# Altium project CarrierMotherboard.PrjPcb (part 1 of 3)
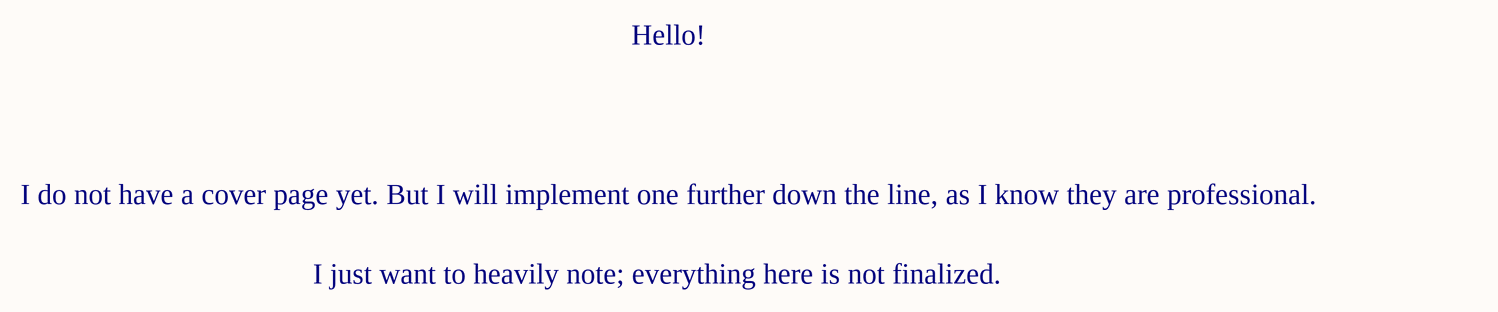
[diagram p0: COVER PAGE.SchDoc]
9 sheets, 274 parts. Net scope: flat (ports and power ports of the same name join across sheets).
Board file: CarrierMotherboard.PcbDoc
Sheets:
  COVER PAGE.SchDoc
  SoM.SchDoc
  eDP.SchDoc
  Power_Delivery.SchDoc
  Battery.SchDoc
  DCDC.SchDoc
  Peripherals.SchDoc
  Audio.SchDoc
  PCIE.SchDoc

## Sheet COVER PAGE.SchDoc
size A; SheetNumber: 1; SheetTotal: 9

### Notes on the sheet
- Hello!
- I do not have a cover page yet. But I will implement one further down the line, as I know they are professional.
- I just want to heavily note; everything here is not finalized.

## Sheet SoM.SchDoc
size A2; SheetNumber: 2; SheetTotal: 9
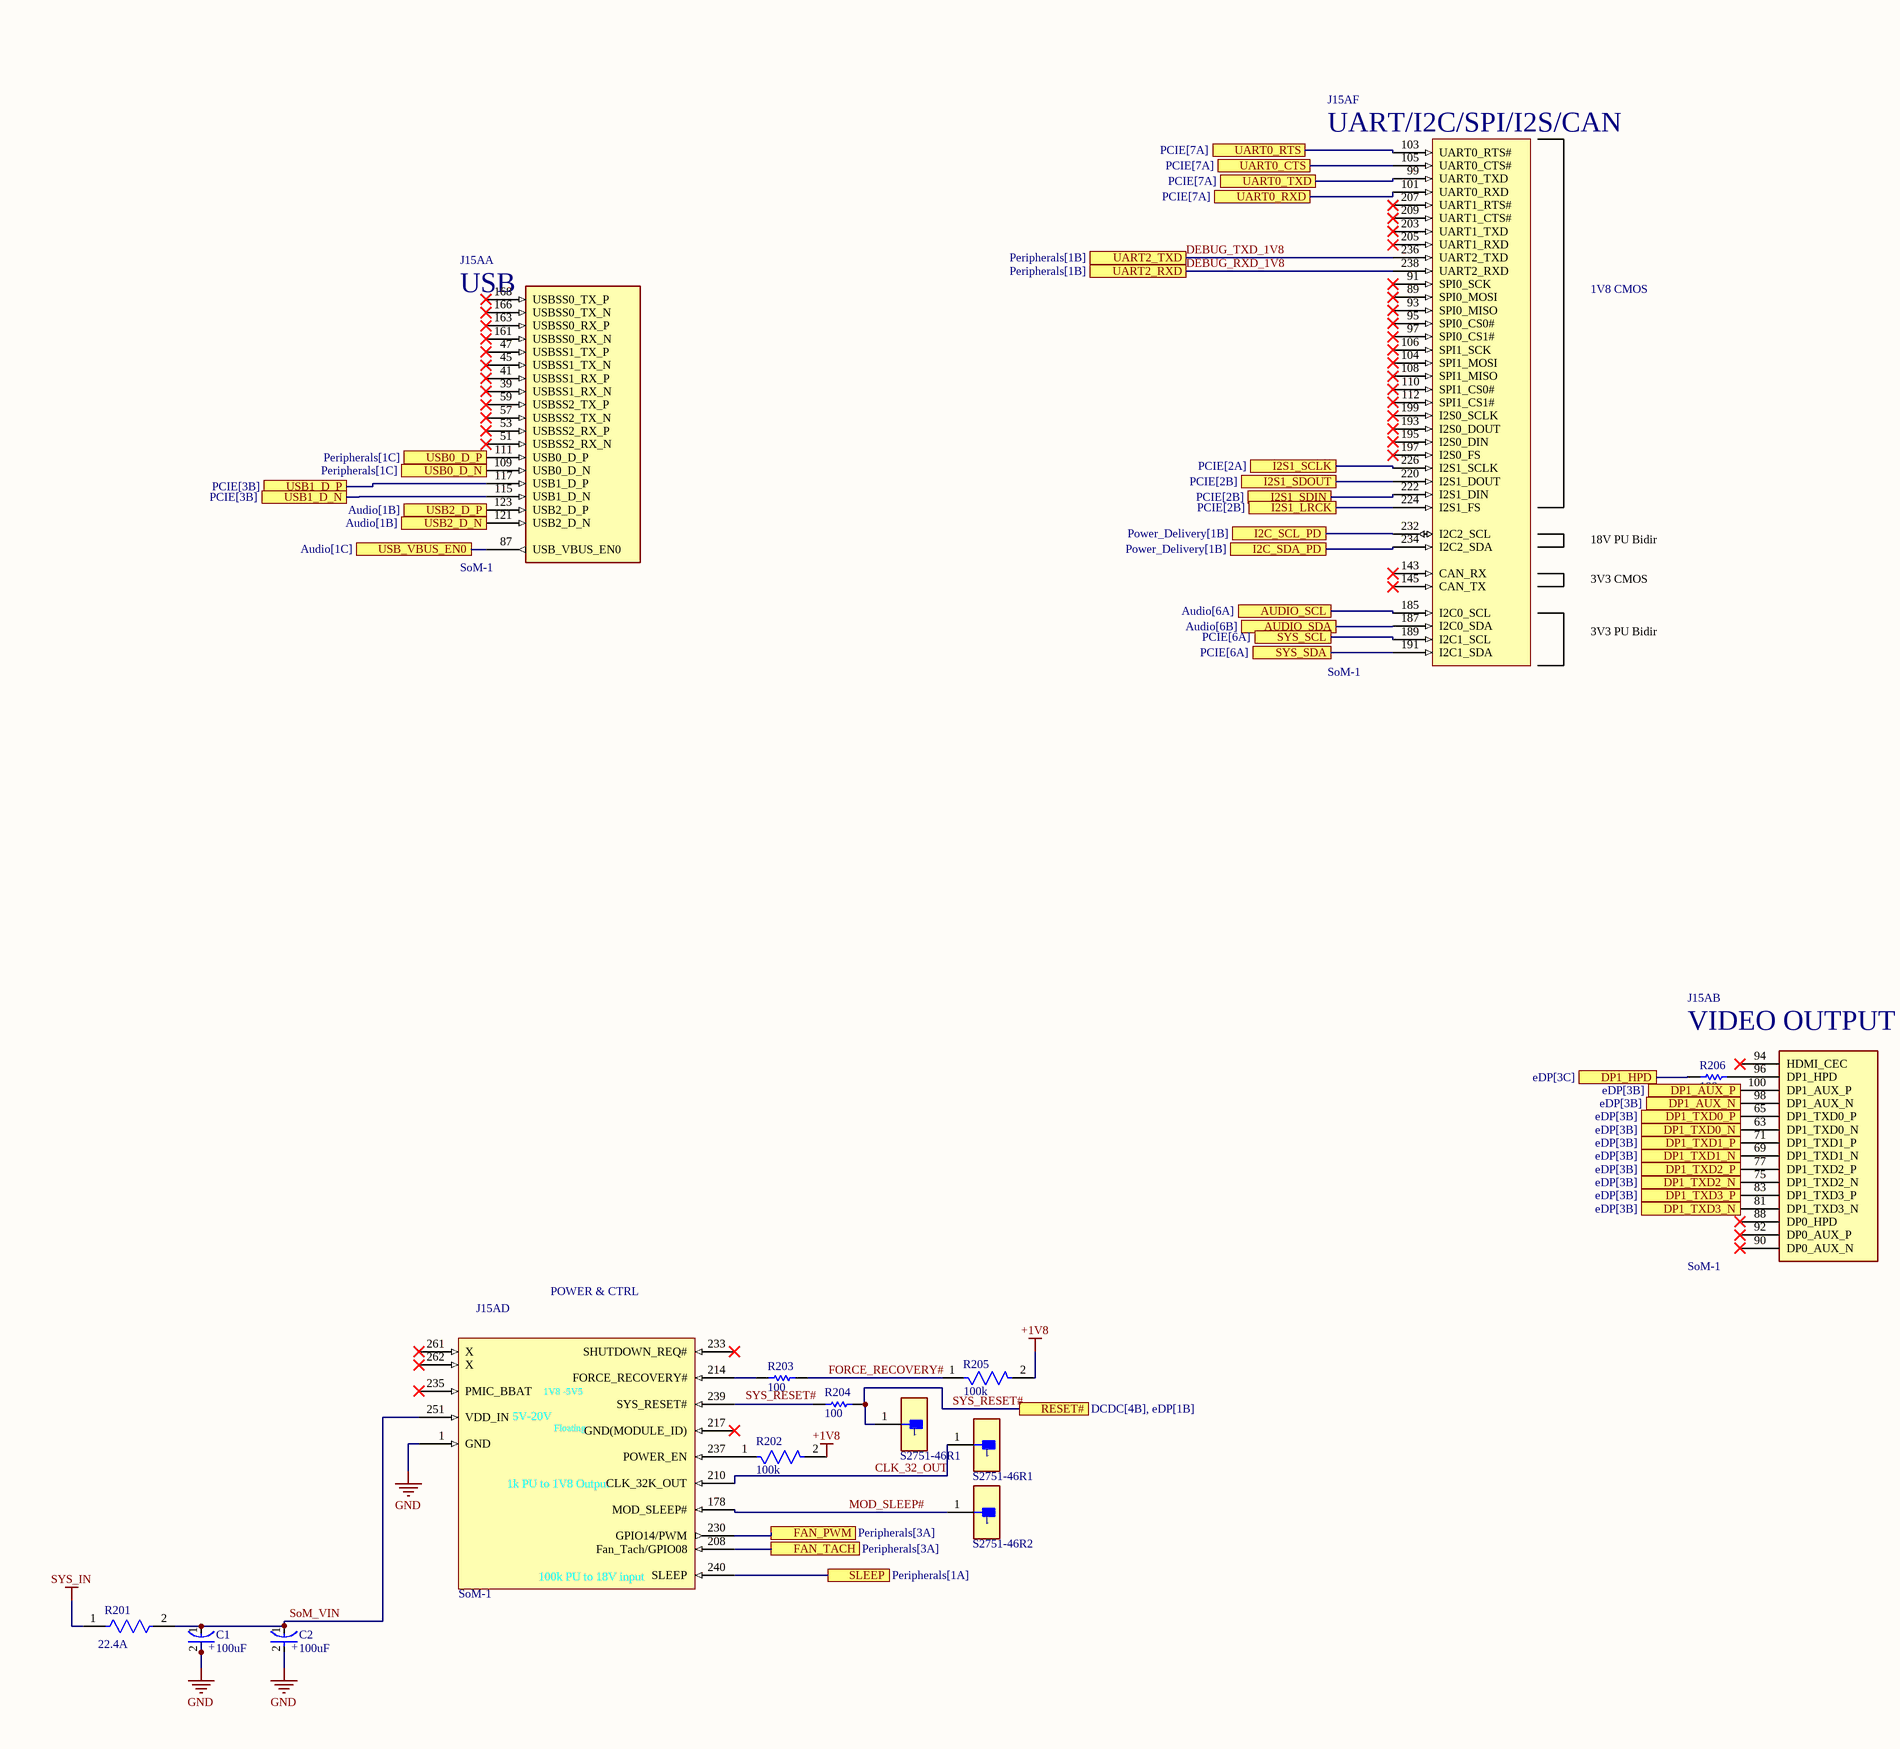
[diagram p1: SoM.SchDoc, left]
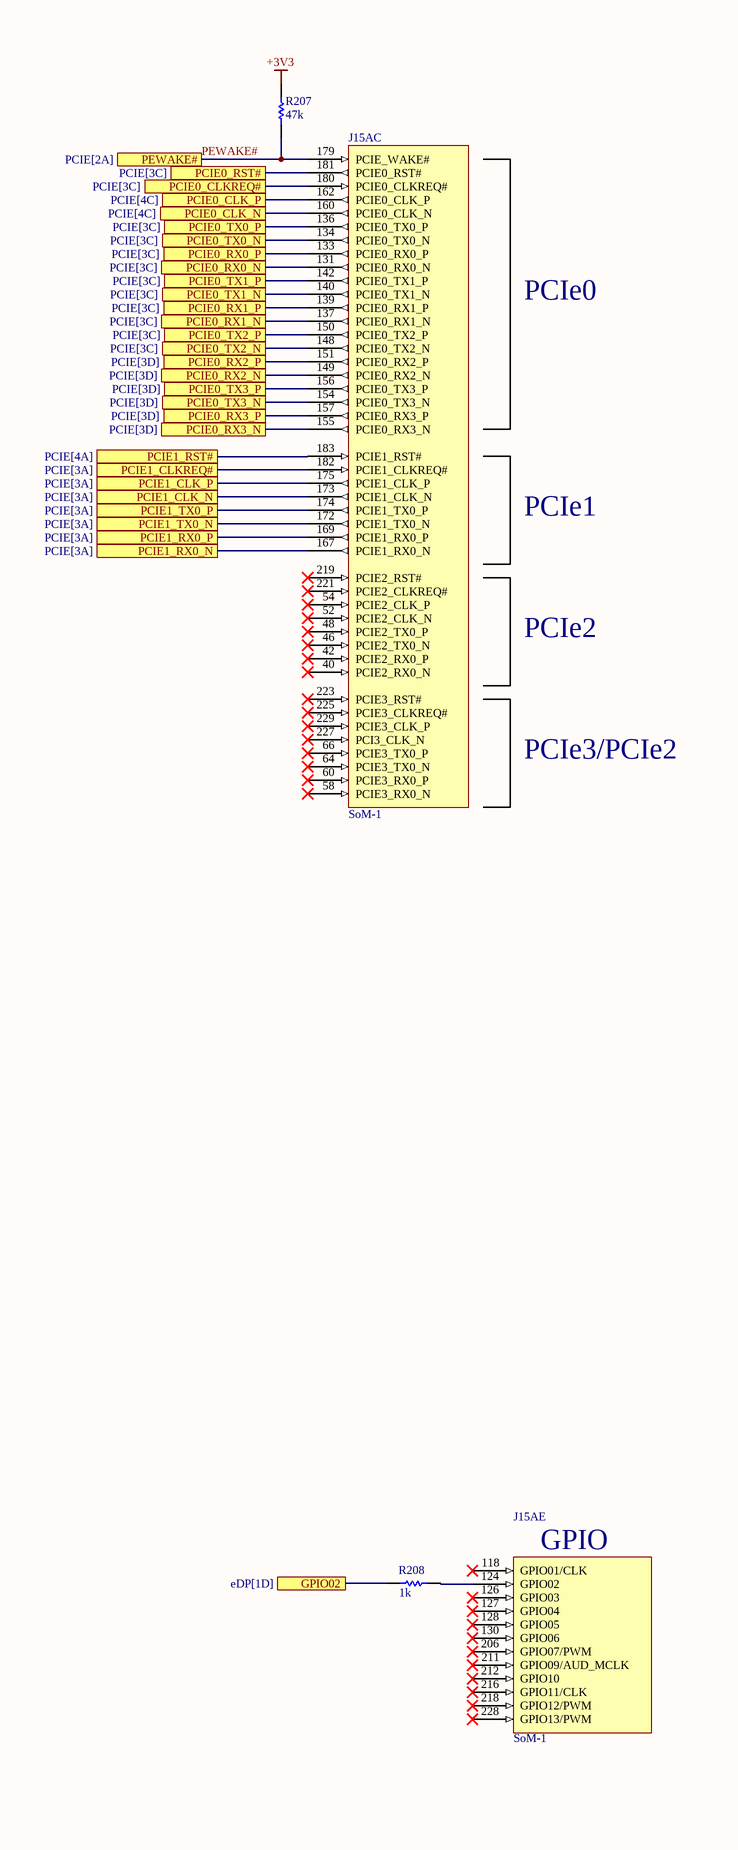
[diagram p2: SoM.SchDoc, right]

### Parts
C1  100uF  [FP-T521D107M025ATE040-MFG]
C2  100uF  [FP-T521D107M025ATE040-MFG]
J15A  SoM-1  [FP-2309413-1-MFG]  (parts A,B,C,D,E,F of 8)
J201  S2751-46R1  [FP-S2751-46R-MFG]
J202  S2751-46R1  [FP-S2751-46R-MFG]
J203  S2751-46R2  [FP-S2751-46R-MFG]
R201  22.4A  [FP-HCJ0603-MFG]
R202  100k  [FP-RC0402-0_4-IPC_A]
R203  100  [RESC1005X40X25ML05T10]
R204  100  [RESC1005X40X25ML05T10]
R205  100k  [FP-RC0402-0_4-IPC_A]
R206  100  [RESC1005X40X25ML05T10]
R207  47k  [RESC1005X40X25ML05T10]
R208  1k  [RESC3216X60X45ML15T20]

### Ports
AUDIO_SCL (see Audio[6A]), AUDIO_SDA (see Audio[6B]), DP1_AUX_N (see eDP[3B]), DP1_AUX_P (see eDP[3B]), DP1_HPD (see eDP[3C]), DP1_TXD0_N (see eDP[3B]), DP1_TXD0_P (see eDP[3B]), DP1_TXD1_N (see eDP[3B]), DP1_TXD1_P (see eDP[3B]), DP1_TXD2_N (see eDP[3B]), DP1_TXD2_P (see eDP[3B]), DP1_TXD3_N (see eDP[3B]), DP1_TXD3_P (see eDP[3B]), FAN_PWM (see Peripherals[3A]), FAN_TACH (see Peripherals[3A]), GPIO02 (see eDP[1D]), I2C_SCL_PD (see Power_Delivery[1B]), I2C_SDA_PD (see Power_Delivery[1B]), I2S1_LRCK (see PCIE[2B]), I2S1_SCLK (see PCIE[2A]), I2S1_SDIN (see PCIE[2B]), I2S1_SDOUT (see PCIE[2B]), PCIE0_CLK_N (see PCIE[4C]), PCIE0_CLK_P (see PCIE[4C]), PCIE0_CLKREQ# (see PCIE[3C]), PCIE0_RST# (see PCIE[3C]), PCIE0_RX0_N (see PCIE[3C]), PCIE0_RX0_P (see PCIE[3C]), PCIE0_RX1_N (see PCIE[3C]), PCIE0_RX1_P (see PCIE[3C]), PCIE0_RX2_N (see PCIE[3D]), PCIE0_RX2_P (see PCIE[3D]), PCIE0_RX3_N (see PCIE[3D]), PCIE0_RX3_P (see PCIE[3D]), PCIE0_TX0_N (see PCIE[3C]), PCIE0_TX0_P (see PCIE[3C]), PCIE0_TX1_N (see PCIE[3C]), PCIE0_TX1_P (see PCIE[3C]), PCIE0_TX2_N (see PCIE[3C]), PCIE0_TX2_P (see PCIE[3C]), PCIE0_TX3_N (see PCIE[3D]), PCIE0_TX3_P (see PCIE[3D]), PCIE1_CLK_N (see PCIE[3A]), PCIE1_CLK_P (see PCIE[3A]), PCIE1_CLKREQ# (see PCIE[3A]), PCIE1_RST# (see PCIE[4A]), PCIE1_RX0_N (see PCIE[3A]), PCIE1_RX0_P (see PCIE[3A]), PCIE1_TX0_N (see PCIE[3A]), PCIE1_TX0_P (see PCIE[3A]), PEWAKE# (see PCIE[2A]), RESET# (see DCDC[4B], eDP[1B]), SLEEP (see Peripherals[1A]), SYS_SCL (see PCIE[6A]), SYS_SDA (see PCIE[6A]), UART0_CTS (see PCIE[7A]), UART0_RTS (see PCIE[7A]), UART0_RXD (see PCIE[7A]), UART0_TXD (see PCIE[7A]), UART2_RXD (see Peripherals[1B]), UART2_TXD (see Peripherals[1B]), USB0_D_N (see Peripherals[1C]), USB0_D_P (see Peripherals[1C]), USB1_D_N (see PCIE[3B]), USB1_D_P (see PCIE[3B]), USB2_D_N (see Audio[1B]), USB2_D_P (see Audio[1B]), USB_VBUS_EN0 (see Audio[1C])

### Nets
+1V8: R202.2 R205.2  [project net 1V8_LDO]
+3V3: R207.2  [project net 3V3_M2]
GND: C1.2(A) C2.2(A) J15A.1(GND)  [project net 3V3_VDRV]
SYS_IN: R201.1
C_PCIE0_RX0_N: J15A.131(PCIE0_RX0_N) ; port PCIE0_RX0_N
C_PCIE0_RX0_P: J15A.133(PCIE0_RX0_P) ; port PCIE0_RX0_P
C_PCIE0_RX1_N: J15A.137(PCIE0_RX1_N) ; port PCIE0_RX1_N
C_PCIE0_RX1_P: J15A.139(PCIE0_RX1_P) ; port PCIE0_RX1_P
C_PCIE0_RX2_N: J15A.149(PCIE0_RX2_N) ; port PCIE0_RX2_N
C_PCIE0_RX2_P: J15A.151(PCIE0_RX2_P) ; port PCIE0_RX2_P
C_PCIE0_TX0_N: J15A.134(PCIE0_TX0_N) ; port PCIE0_TX0_N
C_PCIE0_TX0_P: J15A.136(PCIE0_TX0_P) ; port PCIE0_TX0_P
C_PCIE0_TX1_N: J15A.140(PCIE0_TX1_N) ; port PCIE0_TX1_N
C_PCIE0_TX1_P: J15A.142(PCIE0_TX1_P) ; port PCIE0_TX1_P
C_PCIE0_TX2_N: J15A.148(PCIE0_TX2_N) ; port PCIE0_TX2_N
C_PCIE0_TX2_P: J15A.150(PCIE0_TX2_P) ; port PCIE0_TX2_P
C_PCIE0_TX3_N: J15A.154(PCIE0_TX3_N) ; port PCIE0_TX3_N
C_PCIE0_TX3_P: J15A.156(PCIE0_TX3_P) ; port PCIE0_TX3_P
CLK_32_OUT: J15A.210(CLK_32K_OUT) J202.1
DEBUG_RXD_1V8: J15A.238(UART2_RXD) ; port UART2_RXD
DEBUG_TXD_1V8: J15A.236(UART2_TXD) ; port UART2_TXD
FORCE_RECOVERY#: R203.2 R205.1
I2C_SCL_PD: J15A.232(I2C2_SCL) ; port I2C_SCL_PD
I2C_SDA_PD: J15A.234(I2C2_SDA) ; port I2C_SDA_PD
M2_E_I2C_CLK: J15A.189(I2C1_SCL) ; port SYS_SCL
M2_E_I2C_DAT: J15A.191(I2C1_SDA) ; port SYS_SDA
M2_M_CLKREQ0#: J15A.180(PCIE0_CLKREQ#) ; port PCIE0_CLKREQ#
M2_M_PERST#: J15A.181(PCIE0_RST#) ; port PCIE0_RST#
MOD_SLEEP#: J15A.178(MOD_SLEEP#) J203.1
PCIE0_RX3_N: J15A.155(PCIE0_RX3_N) ; port PCIE0_RX3_N
PCIE0_RX3_P: J15A.157(PCIE0_RX3_P) ; port PCIE0_RX3_P
PCIE1_RX0_N: J15A.167(PCIE1_RX0_N) ; port PCIE1_RX0_N
PCIE1_RX0_P: J15A.169(PCIE1_RX0_P) ; port PCIE1_RX0_P
PCIE1_TX0_P: J15A.174(PCIE1_TX0_P) ; port PCIE1_TX0_P
PEWAKE#: J15A.179(PCIE_WAKE#) R207.1 ; port PEWAKE#
POWER_BUTTON#: J15A.240(SLEEP) ; port SLEEP
SoM_VIN: C1.1(C) C2.1(C) J15A.251(VDD_IN) R201.2
SYS_RESET#: J201.1 R204.2 ; port RESET#
USB_D+: J15A.123(USB2_D_P) ; port USB2_D_P
USB_D-: J15A.121(USB2_D_N) ; port USB2_D_N
NetC102_1: J15A.172(PCIE1_TX0_N) ; port PCIE1_TX0_N
NetD703_1: J15A.109(USB0_D_N) ; port USB0_D_N
NetD704_1: J15A.111(USB0_D_P) ; port USB0_D_P
NetJ15A_63: J15A.63(DP1_TXD0_N) ; port DP1_TXD0_N
NetJ15A_65: J15A.65(DP1_TXD0_P) ; port DP1_TXD0_P
NetJ15A_69: J15A.69(DP1_TXD1_N) ; port DP1_TXD1_N
NetJ15A_71: J15A.71(DP1_TXD1_P) ; port DP1_TXD1_P
NetJ15A_75: J15A.75(DP1_TXD2_N) ; port DP1_TXD2_N
NetJ15A_77: J15A.77(DP1_TXD2_P) ; port DP1_TXD2_P
NetJ15A_81: J15A.81(DP1_TXD3_N) ; port DP1_TXD3_N
NetJ15A_83: J15A.83(DP1_TXD3_P) ; port DP1_TXD3_P
NetJ15A_87: J15A.87(USB_VBUS_EN0) ; port USB_VBUS_EN0
NetJ15A_96: J15A.96(DP1_HPD) R206.2
NetJ15A_98: J15A.98(DP1_AUX_N) ; port DP1_AUX_N
NetJ15A_99: J15A.99(UART0_TXD) ; port UART0_TXD
NetJ15A_100: J15A.100(DP1_AUX_P) ; port DP1_AUX_P
NetJ15A_101: J15A.101(UART0_RXD) ; port UART0_RXD
NetJ15A_103: J15A.103(UART0_RTS#) ; port UART0_RTS
NetJ15A_105: J15A.105(UART0_CTS#) ; port UART0_CTS
NetJ15A_115: J15A.115(USB1_D_N) ; port USB1_D_N
NetJ15A_117: J15A.117(USB1_D_P) ; port USB1_D_P
NetJ15A_124: J15A.124(GPIO02) R208.1
NetJ15A_160: J15A.160(PCIE0_CLK_N) ; port PCIE0_CLK_N
NetJ15A_162: J15A.162(PCIE0_CLK_P) ; port PCIE0_CLK_P
NetJ15A_173: J15A.173(PCIE1_CLK_N) ; port PCIE1_CLK_N
NetJ15A_175: J15A.175(PCIE1_CLK_P) ; port PCIE1_CLK_P
NetJ15A_182: J15A.182(PCIE1_CLKREQ#) ; port PCIE1_CLKREQ#
NetJ15A_183: J15A.183(PCIE1_RST#) ; port PCIE1_RST#
NetJ15A_185: J15A.185(I2C0_SCL) ; port AUDIO_SCL
NetJ15A_187: J15A.187(I2C0_SDA) ; port AUDIO_SDA
NetJ15A_208: J15A.208(Fan_Tach/GPIO08) ; port FAN_TACH
NetJ15A_214: J15A.214(FORCE_RECOVERY#) R203.1
NetJ15A_220: J15A.220(I2S1_DOUT) ; port I2S1_SDOUT
NetJ15A_222: J15A.222(I2S1_DIN) ; port I2S1_SDIN
NetJ15A_224: J15A.224(I2S1_FS) ; port I2S1_LRCK
NetJ15A_226: J15A.226(I2S1_SCLK) ; port I2S1_SCLK
NetJ15A_230: J15A.230(GPIO14/PWM) ; port FAN_PWM
NetJ15A_237: J15A.237(POWER_EN) R202.1
NetJ15A_239: J15A.239(SYS_RESET#) R204.1
NetJ301_27: R206.1 ; port DP1_HPD
NetR208_2: R208.2 ; port GPIO02

Not connected (* = marked no-connect by the designer): J15A 39(USBSS1_RX_N)* 40(PCIE2_RX0_N)* 41(USBSS1_RX_P)* 42(PCIE2_RX0_P)* 45(USBSS1_TX_N)* 46(PCIE2_TX0_N)* 47(USBSS1_TX_P)* 48(PCIE2_TX0_P)* 51(USBSS2_RX_N)* 52(PCIE2_CLK_N)* 53(USBSS2_RX_P)* 54(PCIE2_CLK_P)* 57(USBSS2_TX_N)* 58(PCIE3_RX0_N)* 59(USBSS2_TX_P)* 60(PCIE3_RX0_P)* 64(PCIE3_TX0_N)* 66(PCIE3_TX0_P)* 88(DP0_HPD)* 89(SPI0_MOSI)* 90(DP0_AUX_N)* 91(SPI0_SCK)* 92(DP0_AUX_P)* 93(SPI0_MISO)* 94(HDMI_CEC)* 95(SPI0_CS0#)* 97(SPI0_CS1#)* 104(SPI1_MOSI)* 106(SPI1_SCK)* 108(SPI1_MISO)* 110(SPI1_CS0#)* 112(SPI1_CS1#)* 118(GPIO01/CLK)* 126(GPIO03)* 127(GPIO04)* 128(GPIO05)* 130(GPIO06)* 143(CAN_RX)* 145(CAN_TX)* 161(USBSS0_RX_N)* 163(USBSS0_RX_P)* 166(USBSS0_TX_N)* 168(USBSS0_TX_P)* 193(I2S0_DOUT)* 195(I2S0_DIN)* 197(I2S0_FS)* 199(I2S0_SCLK)* 203(UART1_TXD)* 205(UART1_RXD)* 206(GPIO07/PWM)* 207(UART1_RTS#)* 209(UART1_CTS#)* 211(GPIO09/AUD_MCLK)* 212(GPIO10)* 216(GPIO11/CLK)* 217(GND(MODULE_ID))* 218(GPIO12/PWM)* 219(PCIE2_RST#)* 221(PCIE2_CLKREQ#)* 223(PCIE3_RST#)* 225(PCIE3_CLKREQ#)* 227(PCI3_CLK_N)* 228(GPIO13/PWM)* 229(PCIE3_CLK_P)* 233(SHUTDOWN_REQ#)* 235(PMIC_BBAT)* 261(X)* 262(X)*

### Notes on the sheet
- (near J15A) 1V8 -5V5
- (near J15A) 5V-20V
- (near J15A) Floating
- (near J15A) 1k PU to 1V8 Output
- (near J15A) 100k PU to 18V input
- Labels drawn without touching a wire or pin: SYS_RESET#
- (in symbol CMP-00001-1, part A) USB
- (in symbol CMP-00001-1, part B) VIDEO OUTPUT (eDP)
- (in symbol CMP-00001-1, part C) PCIe0; PCIe1; PCIe2; PCIe3/PCIe2
- (in symbol CMP-00001-1, part D) POWER & CTRL
- (in symbol CMP-00001-1, part E) GPIO
- (in symbol CMP-00001-1, part F) UART/I2C/SPI/I2S/CAN; 1V8 CMOS; 18V PU Bidir; 3V3 CMOS; 3V3 PU Bidir
- (in symbol CMP-03016-000026-1) +

### Library data of the parts
C1 C2 = CMP-03016-000026-1: CAP TANT POLY 100UF 25V 2917; Tolerance: 20%; ESR (Equivalent Series Resistance): 40mR; Min Operating Temperature: -55°C; Voltage Rating: 25V; Width: 0.169inch; Case Code (Imperial): 2917; Packaging: Cut Tape; Max Operating Temperature: 105°C; Length: 0.287inch; Capacitance: 100uF; Voltage Rating (DC): 25V; Features: General Purpose; REACH SVHC: No SVHC; Height - Seated (Max): 0.122inch; Series: KO-CAP® T521; Case/Package: 2917; Case Code (Metric): 7343; Mount: Surface Mount
J15A = CMP-00001-1: Memory Card Connector, DDR4, SODIMM, Cam-In Locking, 260 Contacts, Copper Alloy; Manufacturer Lifecycle Status: ACTIVE; Number of Contacts: 260; Pitch: 500µm; Circuit Application: Power; Voltage Rating: 25V; Max Current Rating: 500mA; Dielectric Material: Polyethylene; Row Spacing: 8.2mm; Shielding: No; Memory Format: DDR, SDRAM; Number of Ports: 1; Contact Material: Gold, Nickel; Lifecycle Status: Production; Packaging: Tape & Reel; Mounting Technology: Surface Mount; Contact Gender: Female; Flammability Rating: UL94 V-0; Height: 18.8mm; Source: 4d1075b24ee2591bdcd47d674b3d2aa.SchLib; Pins: 260; Min Operating Temperature: -55°C; Orientation: Right Angle; Housing Color: Black; Housing Material: Thermoplastic; Sealable: No; Number of Positions: 260; Current Rating: 500mA; RoHS: Compliant; Number of Rows: 2; Contact Plating: Gold, Nickel; China RoHS: Compliant; Terminal Pitch: 500µm; Max Operating Temperature: 85°C; Contact Current Rating: 500mA; Schedule B: 8536694040, 8536694040; REACH SVHC: Yes
J201-J203 = CMP-15817-000010-1: PC TEST POINT NATURAL; Plating: Tin; Body Material: Brass; Color: Natural; Material: Copper Alloy; Mount: Surface Mount; Packaging: Cut Tape
R201 = CMP-26527-000122-1: RES 0 OHM JUMPER 1/4W 0603; Resistance: 0mR; Termination: Wraparound; Mount: Surface Mount; Min Operating Temperature: -55°C; Number of Terminations: 2; Packaging: Tape and Reel; Case Code (Imperial): 0603; Height: 0.021inch; RoHS Compliant: Yes; Width: 0.031inch; Package Quantity: 5000; Max Operating Temperature: 155°C; Radiation Hardening: No; Case/Package: 0603; Length: 0.061inch; Case Code (Metric): 1608
R202 R205 = CMP-2002-07913-2: RES 100K OHM 5% 1/16W 0402; Temperature Coefficient: 100ppm/°C; Max Power Dissipation: 63mW; Resistance: 100kR; Voltage Rating: 50V; Tolerance: 5%; Packaging: Tape and Reel; Termination: SMD/SMT; Case Code (Metric): 1005; Length: 1mm; Power Rating: 63mW; Min Operating Temperature: -55°C; Case/Package: 0402; Construction: Rectangular; Series: RC; Resistance Tolerance: 5%; Height: 0.016inch; Case Code (Imperial): 0402; RoHS Compliant: Yes; Size Code: 0402; Number of Terminations: 2; Features: Moisture Resistant; Width: 0.02inch; Max Operating Temperature: 155°C; Military Standard: Not; Lead Free: Lead Free; Depth: 0.5mm; Package Quantity: 1; Resistor Type: Thick Film
R203 R204 R206 = CMP-2002-07344-1: Part Number: RC0402FR-07100RL; Manufacturer: Yageo / Phycomp
R207 = CMP-2002-07701-1: Part Number: RC0402FR-0747KL; Manufacturer: Yageo / Phycomp
R208 = CMP-2100-03616-1: Chip Resistor, 1 KOhm, +/- 1%, 0.25 W, -55 to 155 degC, 1206 (3216 Metric), RoHS, Tape and Reel; Manufacturer: Vishay Semiconductor; Power Rating: 250mW; Voltage Rating (DC): 200V; Resistance: 1KOhm; Temperature Coefficient: 100ppm/degreesC; Case Code (Imperial): 1206; Length: 3.2mm; Case/Package: 1206; Contact Plating: Tin; Package Quantity: 10; Datasheet URL: http://www.farnell.com/datasheets/1720486.pdf; Mount: SurfaceMount; Package Description: 2-Pin Surface Mount Device, Body 3.15 x 1.6 mm; Package Reference: 1206.0; Max Operating Temperature: 155degC; Lead Free: LeadFree; Weight: 0.000353oz; Military Standard: Not; Max Power Dissipation: 250mW; Case Code (Metric): 3216; Number of Terminations: 2; Tolerance: 1%; Width: 0.063inch; Termination: SMD/SMT; Number of Pins: 2; Min Operating Temperature: -55degC; Height: 0.55mm; Depth: 1.6mm; RoHSCompliant: true; Composition: ThickFilm; Packaging: TapeandReel; Manufacturer URL: http://www.vishay.com/; Voltage Rating: 200V; Radiation Hardening: No; REACH SVHC: Unknown; Datasheet Version: 41061.0

## Sheet eDP.SchDoc
size A4; SheetNumber: 3; SheetTotal: 9
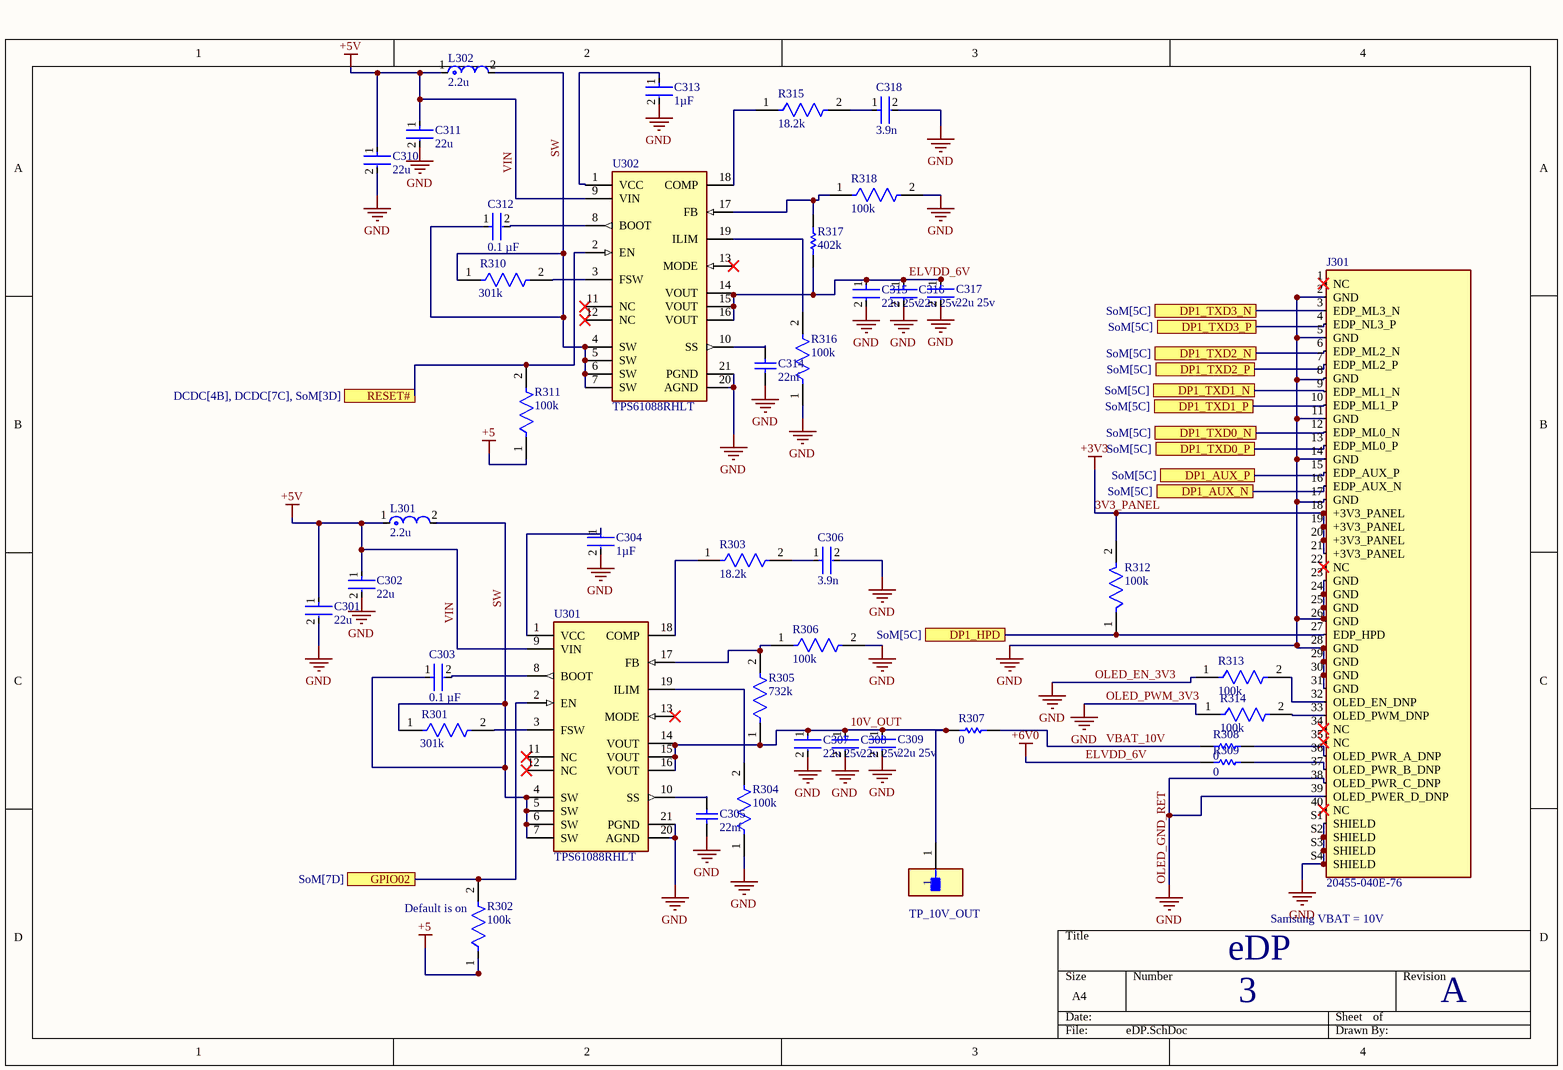
[diagram p3: eDP.SchDoc]

### Parts
C301  22u  [FP-CL10-IPC_B]
C302  22u  [FP-CL10-IPC_B]
C303  0.1 µF  [FP-GRM155-0_05-IPC_B]
C304  1µF  [FP-GRM15-0_1-MFG]
C305  22nf  [CAPC1608X90X35ML10T15]
C306  3.9n  [FP-GRM188-0_1-e0_2_0_5-IPC_B]
C307  22u 25v  [FP-GRM21B-0_2-e0_2_0_7-IPC_B]
C308  22u 25v  [FP-GRM21B-0_2-e0_2_0_7-IPC_B]
C309  22u 25v  [FP-GRM21B-0_2-e0_2_0_7-IPC_B]
C310  22u  [FP-CL10-IPC_B]
C311  22u  [FP-CL10-IPC_B]
C312  0.1 µF  [FP-GRM155-0_05-IPC_B]
C313  1µF  [FP-GRM15-0_1-MFG]
C314  22nf  [CAPC1608X90X35ML10T15]
C315  22u 25v  [FP-GRM21B-0_2-e0_2_0_7-IPC_B]
C316  22u 25v  [FP-GRM21B-0_2-e0_2_0_7-IPC_B]
C317  22u 25v  [FP-GRM21B-0_2-e0_2_0_7-IPC_B]
C318  3.9n  [FP-GRM188-0_1-e0_2_0_5-IPC_B]
J300  TP_10V_OUT  [FP-S2751-46R-MFG]
J301  20455-040E-76  [IPEX_20455-040E-76]
L301  2.2u  [FP-XAL5030-222MEC-MFG]
L302  2.2u  [FP-XAL5030-222MEC-MFG]
R301  301k  [FP-CRCW0603-e3-IPC_C]
R302  100k  [FP-CRCW0603C-e3-MFG]
R303  18.2k  [FP-CRCW0603-e3-IPC_C]
R304  100k  [FP-CRCW0603C-e3-MFG]
R305  732k  [FP-CRCW0603-e3-IPC_B]
R306  100k  [FP-CRCW0603C-e3-MFG]
R307  0  [RESC1005X40X25NL05T10]
R308  0  [RESC1005X40X25NL05T10]
R309  0  [RESC1005X40X25NL05T10]
R310  301k  [FP-CRCW0603-e3-IPC_C]
R311  100k  [FP-CRCW0603C-e3-MFG]
R312  100k  [FP-RC0402-0_4-IPC_A]
R313  100k  [FP-CRCW0603C-e3-MFG]
R314  100k  [FP-CRCW0603C-e3-MFG]
R315  18.2k  [FP-CRCW0603-e3-IPC_C]
R316  100k  [FP-CRCW0603C-e3-MFG]
R317  402k  [RESC1609X50X30ML10T20]
R318  100k  [FP-CRCW0603C-e3-MFG]
U301  TPS61088RHLT  [FP-RHL0020A-MFG]
U302  TPS61088RHLT  [FP-RHL0020A-MFG]

### Ports
DP1_AUX_N (see SoM[5C]), DP1_AUX_P (see SoM[5C]), DP1_HPD (see SoM[5C]), DP1_TXD0_N (see SoM[5C]), DP1_TXD0_P (see SoM[5C]), DP1_TXD1_N (see SoM[5C]), DP1_TXD1_P (see SoM[5C]), DP1_TXD2_N (see SoM[5C]), DP1_TXD2_P (see SoM[5C]), DP1_TXD3_N (see SoM[5C]), DP1_TXD3_P (see SoM[5C]), GPIO02 (see SoM[7D]), RESET# (see DCDC[4B], DCDC[7C], SoM[3D])

### Nets
+3V3: J301.18(+3V3_PANEL) J301.19(+3V3_PANEL) J301.20(+3V3_PANEL) J301.21(+3V3_PANEL) R312.2  [also labelled 3V3_PANEL]  [project net 3V3_M2]
+5: R302.1 R311.1
+5V: C301.1 C302.1 C310.1 C311.1 L301.1 L302.1 U301.9(VIN) U302.9(VIN)  [also labelled VIN]  [project net AVDD]
ELVDD_6V: C315.1 C316.1 C317.1 R309.1 R317.1 U302.14(VOUT) U302.15(VOUT) U302.16(VOUT)  [also labelled +6V0]
GND: C301.2 C302.2 C304.2 C305.1 C306.2 C307.2 C308.2 C309.2 C310.2 C311.2 C313.2 C314.1 C315.2 C316.2 C317.2 C318.2 J301.2(GND) J301.5(GND) J301.8(GND) J301.11(GND) J301.14(GND) J301.17(GND) J301.23(GND) J301.24(GND) J301.25(GND) J301.26(GND) J301.28(GND) J301.29(GND) J301.30(GND) J301.31(GND) J301.38(OLED_PWR_C_DNP) J301.39(OLED_PWER_D_DNP) J301.S1(SHIELD) J301.S2(SHIELD) J301.S3(SHIELD) J301.S4(SHIELD) R304.1 R306.2 R313.1 R314.1 R316.1 R318.2 U301.20(AGND) U301.21(PGND) U302.20(AGND) U302.21(PGND)  [also labelled OLED_EN_3V3, OLED_GND_RET, OLED_PWM_3V3]  [project net 3V3_VDRV]
10V_OUT: C307.1 C308.1 C309.1 J300.1 R305.1 R307.1 U301.14(VOUT) U301.15(VOUT) U301.16(VOUT)
SW: C303.1 C312.1 L301.2 L302.2 R301.1 R310.1 U301.4(SW) U301.5(SW) U301.6(SW) U301.7(SW) U302.4(SW) U302.5(SW) U302.6(SW) U302.7(SW)
SYS_RESET#: R311.2 U302.2(EN) ; port RESET#
VBAT_10V: R307.2 R308.1
NetC303_2: C303.2 U301.8(BOOT)
NetC304_1: C304.1 U301.1(VCC)
NetC305_2: C305.2 U301.10(SS)
NetC306_1: C306.1 R303.2
NetC312_2: C312.2 U302.8(BOOT)
NetC313_1: C313.1 U302.1(VCC)
NetC314_2: C314.2 U302.10(SS)
NetC318_1: C318.1 R315.2
NetJ15A_63: J301.12(EDP_ML0_N) ; port DP1_TXD0_N
NetJ15A_65: J301.13(EDP_ML0_P) ; port DP1_TXD0_P
NetJ15A_69: J301.9(EDP_ML1_N) ; port DP1_TXD1_N
NetJ15A_71: J301.10(EDP_ML1_P) ; port DP1_TXD1_P
NetJ15A_75: J301.6(EDP_ML2_N) ; port DP1_TXD2_N
NetJ15A_77: J301.7(EDP_ML2_P) ; port DP1_TXD2_P
NetJ15A_81: J301.3(EDP_ML3_N) ; port DP1_TXD3_N
NetJ15A_83: J301.4(EDP_NL3_P) ; port DP1_TXD3_P
NetJ15A_98: J301.16(EDP_AUX_N) ; port DP1_AUX_N
NetJ15A_100: J301.15(EDP_AUX_P) ; port DP1_AUX_P
NetJ301_27: J301.27(EDP_HPD) R312.1 ; port DP1_HPD
NetJ301_32: J301.32(OLED_EN_DNP) R313.2
NetJ301_33: J301.33(OLED_PWM_DNP) R314.2
NetJ301_36: J301.36(OLED_PWR_A_DNP) R308.2
NetJ301_37: J301.37(OLED_PWR_B_DNP) R309.2
NetR208_2: R302.2 U301.2(EN) ; port GPIO02
NetR301_2: R301.2 U301.3(FSW)
NetR303_1: R303.1 U301.18(COMP)
NetR304_2: R304.2 U301.19(ILIM)
NetR305_2: R305.2 R306.1 U301.17(FB)
NetR310_2: R310.2 U302.3(FSW)
NetR315_1: R315.1 U302.18(COMP)
NetR316_2: R316.2 U302.19(ILIM)
NetR317_2: R317.2 R318.1 U302.17(FB)

Not connected (* = marked no-connect by the designer): J301 1(NC)* 22(NC)* 34(NC)* 35(NC)* 40(NC)*; U301 11(NC)* 12(NC)* 13(MODE)*; U302 11(NC)* 12(NC)* 13(MODE)*

### Notes on the sheet
- (near R302) Default is on
- (near J301) Samsung VBAT = 10V
- eDP
- 3
- A

### Library data of the parts
C301 C302 C310 C311 = CMP-13271-002755-1: Cap Ceramic 22uF 16V X5R ±20% Pad SMD 0603 +85°C T/R; Mount: Surface Mount; Packaging: Tape and Reel; Case Code (Imperial): 0603; Max Operating Temperature: 85°C; Capacitance: 22uF; Case/Package: 0603; Voltage Rating: 16V; Tolerance: 20%; Case Code (Metric): 1608; Min Operating Temperature: -55°C
C303 C312 = CMP-06035-003750-1: Chip Multilayer Ceramic Capacitors for General Purpose, 0402, 0.10uF, X7R, 15%, 10%, 50V; Capacitance: 100nF; Weight: 0.000212oz; Package Quantity: 50000; Resistor Type: Ceramic; Mount: Surface Mount; Width: 0.5mm; Case Code (Imperial): 0402; Termination: SMD/SMT; Case/Package: 0402; Voltage Rating: 50V; Height: 0.5mm; Length: 0.039inch; Dielectric: X7R; Case Code (Metric): 1005; Min Operating Temperature: -55°C; Thickness: 0.022inch; Tolerance: 10%; Lead Free: Lead Free; Packaging: Tape and Reel; Max Operating Temperature: 125°C; Voltage Rating (DC): 50V
C304 C313 = CMP-2008-04556-2: CAP CER 1UF 10V X5R 0402; Manufacturer Part Number: GRM155R61A105KE15D; Manufacturer: Murata; Material: Ceramic; Tolerance: 10%; Temperature Coefficient: 15%; Octopart: https://octopart.com/grm155r61a105ke15d-murata-197442; Lead Free: Yes; ComponentLink2Description: Datasheet; Temperature: -55°C to +85°C; Temperature Range High: +85°C; Height: 0.55mm; Capacitance: 1uF; Ipc Land Pattern Name: CAPC10050X50; ComponentLink2URL: https://search.murata.co.jp/Ceramy/image/img/A01X/G101/ENG/GRM155R61A105KE15-01A.pdf; Temperature Range Low: -55°C; Device Class L2: Capacitors; Voltage Rating: 10V; RoHS: TRUE; Device Class L1: Passive Components; Device Class L3: Ceramic Capacitors; Temperature Characteristic: X5R; Mouser Description: 0402 1 uF 10 V ±10% Tolerance X5R Surface Mount Multilayer Ceramic Capacitor; Automotive: No; Package: GRM15-0.1; Digikey Description: CAP CER 1UF 10V X5R 0402; Value: 1uF; Category: Cap
C305 C314 = CMP-2006-02910-1: Manufacturer: Murata; Part Number: GRM188R71H223KA01D
C306 C318 = CMP-06035-027218-1: Chip Multilayer Ceramic Capacitors for General Purpose, 0603, 3900pF, C0G, 30ppm/°C, 5%, 50V; Capacitance: 3.9nF; Voltage: 50V; Case Code (Metric): 1608; Min Operating Temperature: -55°C; Weight: 0.000222oz; Packaging: Tape and Reel; Case/Package: 0603; Package Quantity: 10000; Tolerance: 5%; Width: 0.8mm; Mount: Surface Mount; Length: 0.063inch; Termination: SMD/SMT; Voltage Rating (DC): 50V; Thickness: 0.035inch; Max Operating Temperature: 125°C; Height: 0.8mm; Dielectric: C0G; Voltage Rating: 50V; Case Code (Imperial): 0603
C307-C309 C315-C317 = CMP-2007-03222-3: Chip Multilayer Ceramic Capacitors for General Purpose, 0805, 22uF, X5R, 15%, 20%, 25V; Case/Package: 0805; Depth: 1.25mm; Resistor Type: Ceramic; Voltage Rating: 25V; Lead Free: Lead Free; Voltage Rating (DC): 25V; Case Code (Metric): 2012; Thickness: 0.057inch; REACH SVHC: No SVHC; Material: Ceramic; Tolerance: 20%; Length: 2mm; Capacitance: 22uF; Case Code (Imperial): 0805; Max Operating Temperature: 85°C; Termination: SMD/SMT; Weight: 0.000335oz; Dielectric: X5R; Packaging: Tape and Reel; Voltage: 25V; Package Quantity: 3000; Height: 1.25mm; Mount: Surface Mount; Width: 1.25mm; Min Operating Temperature: -55°C
J300 = CMP-15817-000010-1: 10V nominal; Plating: Tin; Body Material: Brass; Color: Natural; Material: Copper Alloy; Mount: Surface Mount; Packaging: Cut Tape
J301 = CMP-002-00071-3: Conn Wire to Board RCP 40 POS 0.5mm Solder RA Side Entry SMDCABLINE® T/R; Pins: 40; Contact Gender: Female
L301 L302 = CMP-11268-000158-1: Fixed Inductors 2.2uH Shld 20% 9.2A 14.5mOhms AECQ2 SRF: 38MHz Test Freq: 1MHz; Test Frequency: 100kHz; Core Material: Composite; Shielding: Shielded; DC Resistance (DCR): 14.5mR; RMS Current (Irms): 9.7A; Max Operating Temperature: 125°C; Self Resonant Frequency: 38MHz; Package Quantity: 400; Min Operating Temperature: -40°C; Width: 5.48mm; Series: XAL5030; Inductance: 2.2uH; Length: 5.68mm; RoHS Compliant: Yes; Termination: SMD/SMT; Packaging: Tape and Reel; Max DC Current: 9.2A; Saturation Current: 9.2A; Lead Free: Contains Lead; Mount: Surface Mount; Case/Package: SMD/SMT; Height: 3.1mm; Inductance Tolerance: 20%; Tolerance: 20%
R301 R310 = CMP-2000-03218-2: RES Thick Film, 301kΩ, 1%, 0.1W, 100ppm/°C, 0603; Voltage Rating: 75V; Max Power Dissipation: 100mW; Resistance: 301kR; Case Code (Metric): 1608; Weight: 7.1E-05oz; Military Standard: Not; Depth: 0.85mm; Temperature Coefficient: 100ppm/°C; Case Code (Imperial): 0603; Termination: SMD/SMT; Tolerance: 1%; Mount: Surface Mount; Case/Package: 0603; Number of Terminations: 2; Working Voltage: 75V; Number of Pins: 2; Max Operating Temperature: 155°C; Voltage Rating (DC): 75V; Height: 0.45mm; Length: 1.55mm; Packaging: Tape and Reel; Contact Plating: Tin; Radiation Hardening: No; Features: Automotive AEC-Q200; Composition: Thick Film; Min Operating Temperature: -55°C; Lead Free: Lead Free; Power Rating: 100mW; Width: 0.033inch; Package Quantity: 10
R302 R304 R306 R311 R313 R314 R316 R318 = CMP-02407-011574-1: RES SMD 100K OHM 1% 1/10W 0603; Temperature Coefficient: 100ppm/°C; Resistance: 100kR; Power Rating: 100mW; Contact Plating: Tin; Length: 1.55mm; Mount: Surface Mount; Min Operating Temperature: -55°C; RoHS Compliant: Yes; Max Operating Temperature: 155°C; Tolerance: 1%; Resistor Type: Thick Film; Termination: Wraparound; Case/Package: Molded; Lead Free: Lead Free
R303 R315 = CMP-2000-02961-2: RES Thick Film, 18.2kΩ, 1%, 0.1W, 100ppm/°C, 0603; Working Voltage: 75V; Resistance: 18.2kR; Max Power Dissipation: 100mW; Temperature Coefficient: 100ppm/°C; Width: 0.85mm; Termination: SMD/SMT; Voltage Rating (DC): 75V; Length: 1.55mm; Max Operating Temperature: 155°C; Radiation Hardening: No; Min Operating Temperature: -55°C; Composition: Thick Film; Contact Plating: Tin; Case Code (Metric): 1608; Tolerance: 1%; Power Rating: 100mW; Case/Package: 0603; Case Code (Imperial): 0603; Weight: 7.1E-05oz; Number of Terminations: 2; Package Quantity: 10; Packaging: Tape and Reel; Lead Free: Lead Free; Military Standard: Not; Voltage Rating: 75V; Height: 0.45mm; Features: Automotive AEC-Q200; Number of Pins: 2; Depth: 0.85mm
R305 = CMP-1012-00834-2: RES Thick Film, 732kΩ, 1%, 0.1W, 100ppm/°C, 0603; Power Rating: 100mW; Resistance: 732kR; Voltage Rating: 75V; Number of Terminations: 2; Temperature Coefficient: 100ppm/°C; Tolerance: 1%; Package Quantity: 10; Case/Package: 0603; Max Power Dissipation: 100mW; Features: Automotive AEC-Q200; Height: 0.02inch; Military Standard: Not; Contact Plating: Tin; Radiation Hardening: No; Case Code (Imperial): 0603; Depth: 0.85mm; Number of Pins: 2; Min Operating Temperature: -55°C; Width: 0.033inch; Weight: 7.1E-05oz; Composition: Thick Film; Packaging: Tape and Reel; Length: 1.55mm; Termination: SMD/SMT; Case Code (Metric): 1608; Max Operating Temperature: 155°C
R307-R309 = CMP-1011-00001-2: Manufacturer: Yageo / Phycomp; Part Number: RC0402JR-070RL
R312 = CMP-2002-07913-2: as R202 on sheet SoM; Tolerance: 5%; Packaging: Tape and Reel; Termination: SMD/SMT; Case Code (Metric): 1005; Length: 1mm; Power Rating: 63mW; Min Operating Temperature: -55°C; Case/Package: 0402; Construction: Rectangular; Series: RC; Resistance Tolerance: 5%; Height: 0.016inch; Case Code (Imperial): 0402; RoHS Compliant: Yes; Size Code: 0402; Number of Terminations: 2; Features: Moisture Resistant; Width: 0.02inch; Max Operating Temperature: 155°C; Military Standard: Not; Lead Free: Lead Free; Depth: 0.5mm; Package Quantity: 1; Resistor Type: Thick Film
R317 = CMP-2000-03334-1: Manufacturer: Vishay Dale; Part Number: CRCW0603402KFKEA
U301 U302 = CMP-04918-000117-1: IC REG BOOST ADJ 10A 20VQFN; Manufacturer: Texas Instruments; Output Voltage: 4.5-12.6V; Max Junction Temp: +125°C; Max Duty Cycle: 90%; Output Type: AdjustableProgrammable; Nominal Supply Current: 1-110uA; Min Supply Voltage: 2.7V; Switching Frequency: 200-2200kHz; Number Of Outputs: 1; Max Supply Voltage: 12V; Manufacturer Part Number: TPS61088RHLT; Digikey Description: IC REG BOOST ADJ 10A 20VQFN; Octopart: https://octopart.com/tps61088rhlt-texas+instruments-57155059; Switching Topology: Boost; Lead Free: Yes; Output Current: 10A; Height: 1mm; Temperature: -40°C to +85°C; Package: RHL0020A; Device Class L3: Voltage Regulators - Switching; RoHS: TRUE; Temperature Range Low: -40°C; Temperature Range High: +85°C; Device Class L1: Integrated Circuits (ICs); Automotive: No; Category: IC; ComponentLink2Description: Datasheet; ComponentLink2URL: http://www.ti.com/lit/ds/symlink/tps61088.pdf; Device Class L2: Power Management ICs

## Sheet Power_Delivery.SchDoc
size A3; SheetNumber: 4; SheetTotal: 9
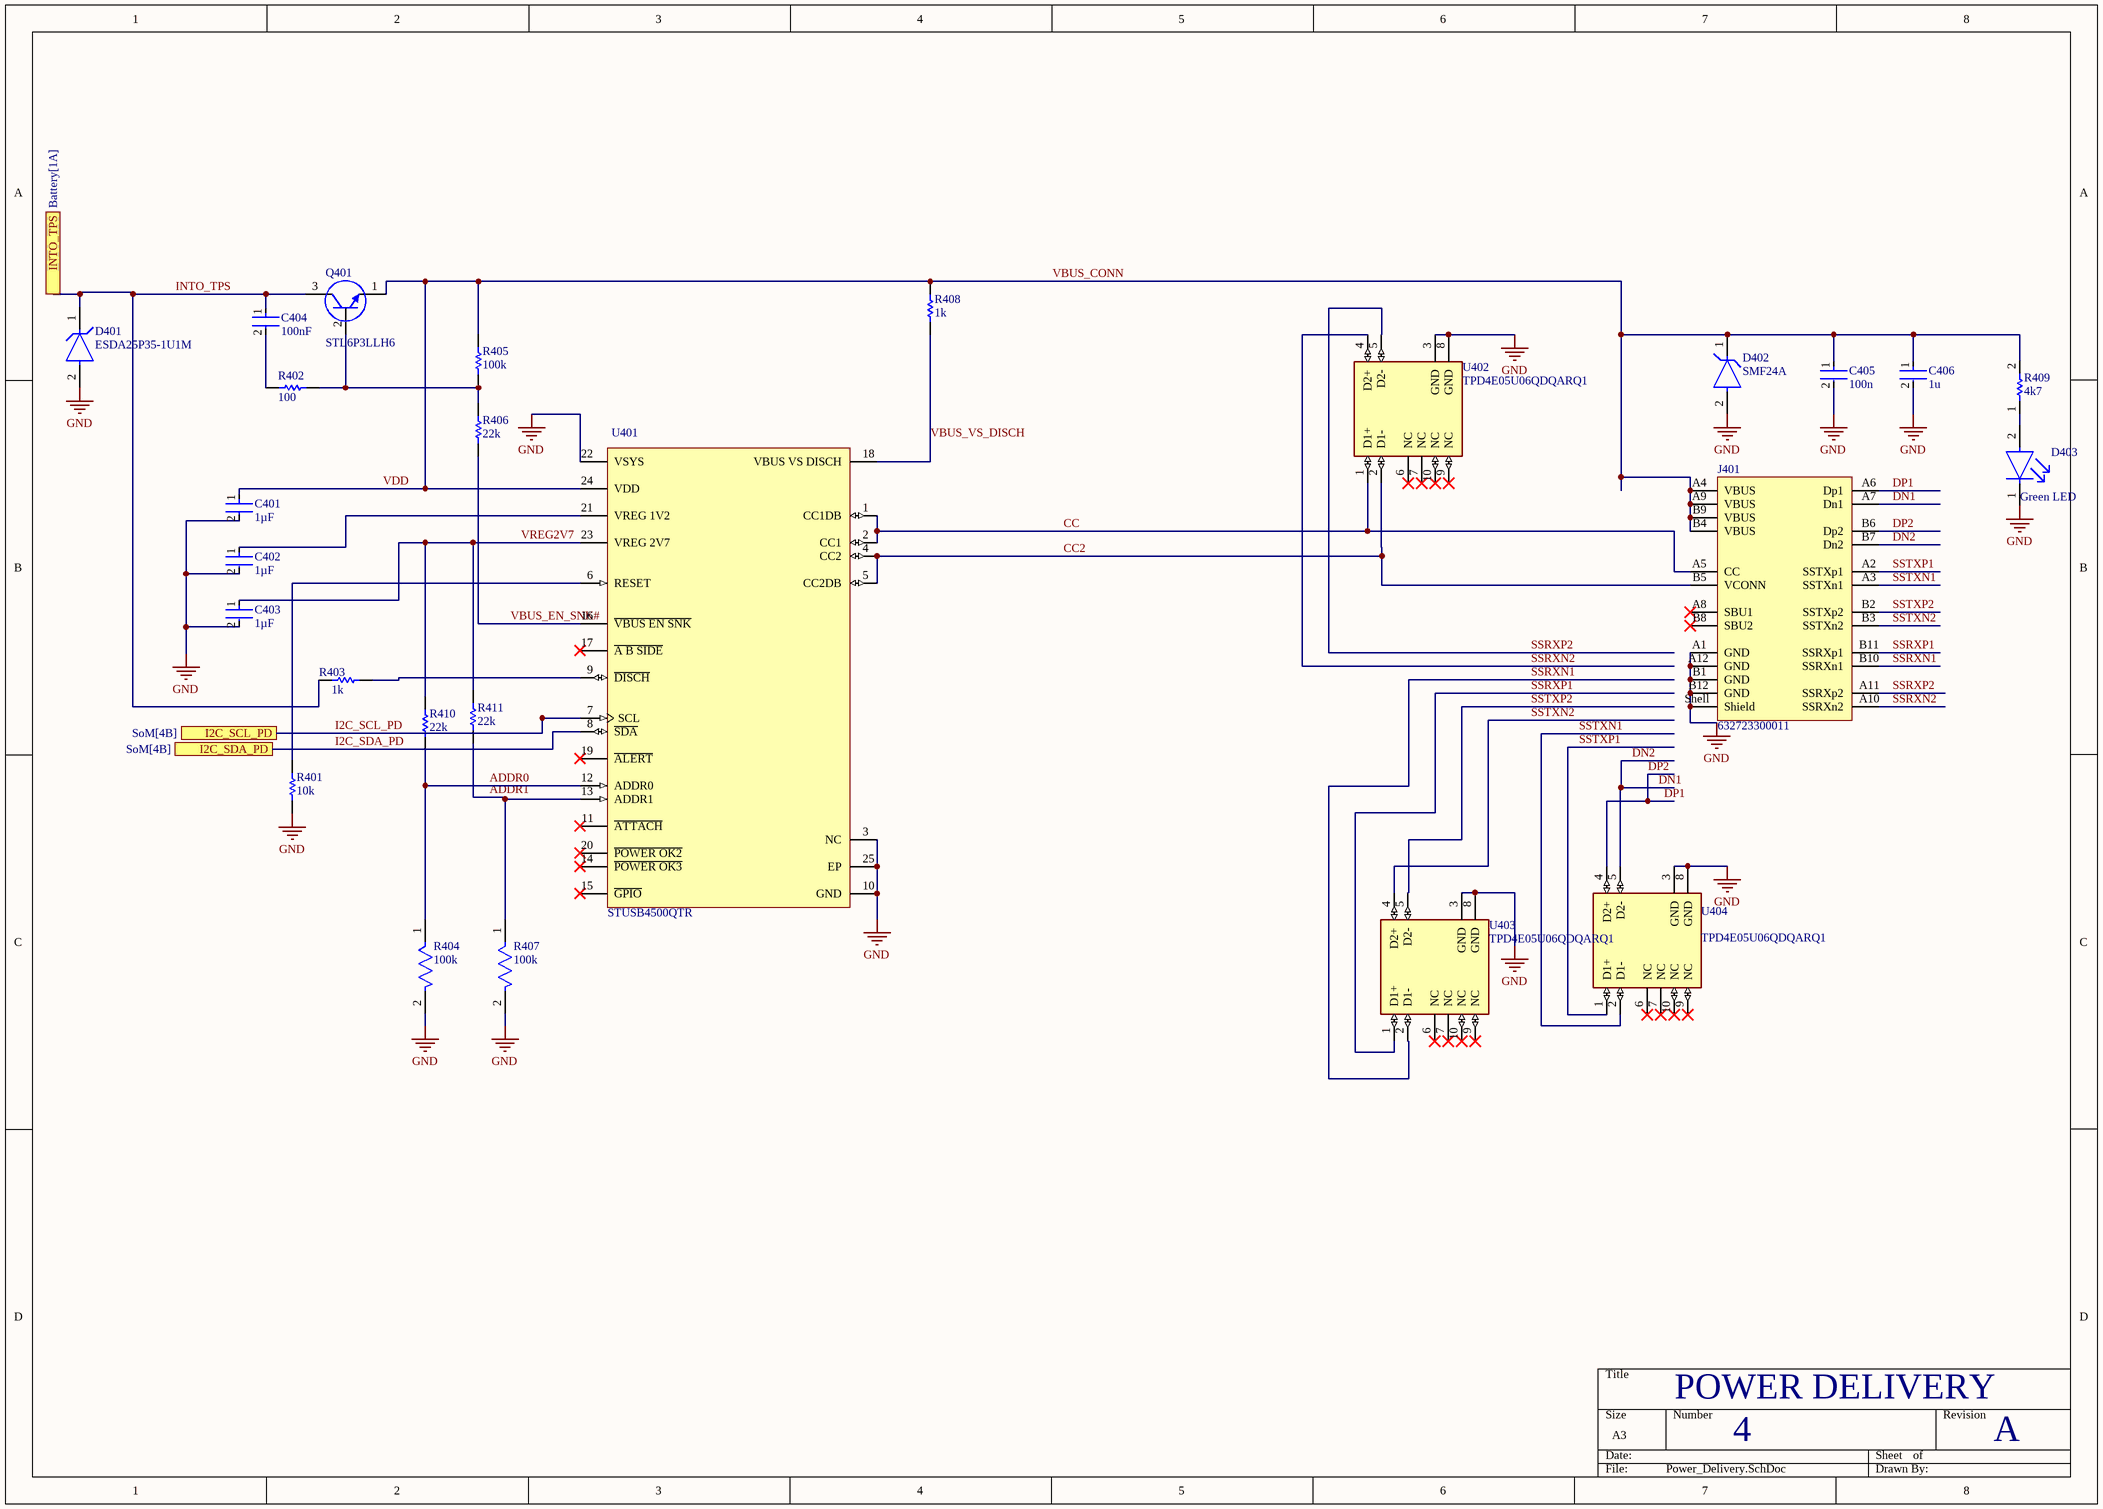
[diagram p4: Power_Delivery.SchDoc]

### Parts
C401  1µF  [FP-GRM15-0_1-MFG]
C402  1µF  [FP-GRM15-0_1-MFG]
C403  1µF  [FP-GRM15-0_1-MFG]
C404  100nF  [FP-GRM155-0_05-IPC_B]
C405  100n  [FP-GRM155-0_05-IPC_B]
C406  1u  [FP-GRM155-0_1-IPC_C]
D401  ESDA25P35-1U1M  [FP-QFN_1610-MFG]
D402  SMF24A  [FP-SMF24A-MFG]
D403  Green LED  [FP-LTST-C190GKT-MFG]
J401  632723300011  [632723300011]
Q401  STL6P3LLH6  [TRANS_STL6P3LLH6]
R401  10k  [RESC1005X40X25LL05T10]
R402  100  [RESC1005X40X25ML05T10]
R403  1k  [RESC3216X60X45ML15T20]
R404  100k  [FP-RC0402-0_4-IPC_A]
R405  100k  [RESC1005X40X25NL05T10]
R406  22k  [RESC1005X40X25NL05T05]
R407  100k  [FP-RC0402-0_4-IPC_A]
R408  1k  [RESC3216X60X45ML15T20]
R409  4k7  [RESC1005X40X25NL10T10]
R410  22k  [RESC1005X40X25NL05T10]
R411  22k  [RESC1005X40X25NL05T10]
U401  STUSB4500QTR  [FP-QFN-24-EP_4x4-MFG]
U402  TPD4E05U06QDQARQ1  [FP-DQA0010A-MFG]
U403  TPD4E05U06QDQARQ1  [FP-DQA0010A-MFG]
U404  TPD4E05U06QDQARQ1  [FP-DQA0010A-MFG]

### Ports
I2C_SCL_PD (see SoM[4B]), I2C_SDA_PD (see SoM[4B]), INTO_TPS (see Battery[1A])

### Nets
GND: C401.2 C402.2 C403.2 C405.2 C406.2 D401.2(A) D402.2(A) D403.1(C) J401.A1(GND) J401.A12(GND) J401.B1(GND) J401.B12(GND) J401.Shell(Shield) R401.1 R404.2 R407.2 U401.3(NC) U401.10(GND) U401.22(VSYS) U401.25(EP) U402.3(GND) U402.8(GND) U403.3(GND) U403.8(GND) U404.3(GND) U404.8(GND)  [project net 3V3_VDRV]
ADDR0: R404.1 R410.1 U401.12(ADDR0)
ADDR1: R407.1 R411.1 U401.13(ADDR1)
CC: J401.A5(CC) U401.1(CC1DB) U401.2(CC1) U402.1(D1+)
CC2: J401.B5(VCONN) U401.4(CC2) U401.5(CC2DB) U402.2(D1-)
DN1: J401.A7(Dn1) J401.B7(Dn2) U404.5(D2-)  [also labelled DN2]
DP1: J401.A6(Dp1) J401.B6(Dp2) U404.4(D2+)  [also labelled DP2]
I2C_SCL_PD: U401.7(SCL) ; port I2C_SCL_PD
I2C_SDA_PD: U401.8(~{SDA}) ; port I2C_SDA_PD
INTO_TPS: C404.1 D401.1(C) Q401.3(C) R403.2 ; port INTO_TPS
SSRXN1: J401.B10(SSRXn1) U403.2(D1-)
SSRXN2: J401.A10(SSRXn2) U402.4(D2+)
SSRXP1: J401.B11(SSRXp1) U403.1(D1+)
SSRXP2: J401.A11(SSRXp2) U402.5(D2-)
SSTXN1: J401.A3(SSTXn1) U404.2(D1-)
SSTXN2: J401.B3(SSTXn2) U403.4(D2+)
SSTXP1: J401.A2(SSTXp1) U404.1(D1+)
SSTXP2: J401.B2(SSTXp2) U403.5(D2-)
VBUS_CONN: C401.1 C405.1 C406.1 D402.1(C) J401.A4(VBUS) J401.A9(VBUS) J401.B4(VBUS) J401.B9(VBUS) Q401.1(E) R405.2 R408.2 R409.2 U401.24(VDD)  [also labelled VDD]
VBUS_EN_SNK#: R406.1 U401.16(~{VBUS_EN_SNK})
VBUS_VS_DISCH: R408.1 U401.18(VBUS_VS_DISCH)
VREG2V7: C403.1 R410.2 R411.2 U401.23(VREG_2V7)
NetC402_1: C402.1 U401.21(VREG_1V2)
NetC404_2: C404.2 R402.1
NetD403_2: D403.2(A) R409.1
NetQ401_2: Q401.2(B) R402.2 R405.1 R406.2
NetR401_2: R401.2 U401.6(RESET)
NetR403_1: R403.1 U401.9(~{DISCH})

Not connected (* = marked no-connect by the designer): J401 A8(SBU1)* B8(SBU2)*; U401 11(~{ATTACH})* 14(~{POWER_OK3})* 15(~{GPIO})* 17(~{A_B_SIDE})* 19(~{ALERT})* 20(~{POWER_OK2})*; U402 6(NC)* 7(NC)* 9(NC)* 10(NC)*; U403 6(NC)* 7(NC)* 9(NC)* 10(NC)*; U404 6(NC)* 7(NC)* 9(NC)* 10(NC)*

### Notes on the sheet
- POWER DELIVERY
- 4
- A

### Library data of the parts
C401-C403 = CMP-2008-04556-2: as C304 on sheet eDP; Octopart: https://octopart.com/grm155r61a105ke15d-murata-197442; Lead Free: Yes; ComponentLink2Description: Datasheet; Temperature: -55°C to +85°C; Temperature Range High: +85°C; Height: 0.55mm; Capacitance: 1uF; Ipc Land Pattern Name: CAPC10050X50; ComponentLink2URL: https://search.murata.co.jp/Ceramy/image/img/A01X/G101/ENG/GRM155R61A105KE15-01A.pdf; Temperature Range Low: -55°C; Device Class L2: Capacitors; Voltage Rating: 10V; RoHS: TRUE; Device Class L1: Passive Components; Device Class L3: Ceramic Capacitors; Temperature Characteristic: X5R; Mouser Description: 0402 1 uF 10 V ±10% Tolerance X5R Surface Mount Multilayer Ceramic Capacitor; Automotive: No; Package: GRM15-0.1; Digikey Description: CAP CER 1UF 10V X5R 0402; Value: 1uF; Category: Cap
C404 = CMP-2008-04639-2: Chip Multilayer Ceramic Capacitors for General Purpose, 0402, 0.10uF, X7R, 15%, 10%, 50V; Dissipation Factor: 0.025%; Weight: 0.000212oz; Thickness: 0.022inch; Voltage Rating (DC): 50V; Dielectric Material: Ceramic; Termination: SMD/SMT; Case/Package: 0402; Case Code (Imperial): 0402; Mount: Surface Mount; REACH SVHC: No SVHC; Resistor Type: Ceramic; Dielectric: X7R; Max Operating Temperature: 125°C; Voltage: 50V; Lead Free: Lead Free; Package Quantity: 10000; Packaging: Tape and Reel; Capacitance: 100nF; Length: 1mm; Material: Ceramic; Height: 0.5mm; Depth: 0.5mm; Width: 0.5mm; Min Operating Temperature: -55°C; Tolerance: 10%; Case Code (Metric): 1005; Voltage Rating: 50V
C405 = CMP-06035-003982-1: Chip Multilayer Ceramic Capacitors for General Purpose, 0402, 0.10uF, X5R, 15%, 10%, 50V; Dissipation Factor: 0.025%; Capacitance: 100nF; Resistor Type: Ceramic; Max Operating Temperature: 85°C; Dielectric Material: Ceramic; Voltage Rating: 50V; Voltage Rating (DC): 50V; REACH SVHC: No SVHC; Case/Package: 0402; Voltage: 50V; Mount: Surface Mount; Case Code (Imperial): 0402; Length: 1mm; Packaging: Tape and Reel; Dielectric: X5R; Lead Free: Lead Free; Weight: 0.000212oz; Package Quantity: 10000; Termination: SMD/SMT; Depth: 0.5mm; Width: 0.02inch; Height: 0.5mm; Min Operating Temperature: -55°C; Case Code (Metric): 1005; Tolerance: 10%; Thickness: 0.022inch
C406 = CMP-06035-026280-1: Chip Multilayer Ceramic Capacitors for General Purpose, 0402, 1.0uF, X5R, 15%, 10%, 25V; Capacitance: 1uF; Voltage Rating (DC): 25V; Width: 500um; Thickness: 500um; Length: 1mm; Tolerance: 10%; Dielectric: X5R
D401 = CMP-12225-000030-1: TVS DIODE 22V 41V 1610; Manufacturer: STMicroelectronics; Clamping Voltage: 39V; Breakdown Voltage: 23.3V; Max Junction Temp: +150°C; Peak Pulse Current: 35A; Number Of Channels: 1; Peak Pulse Power: 1400W; Standoff Height: 0.02mm; Direction: Unidirectional; ComponentLink2URL: https://www.st.com/resource/en/datasheet/esda25p35-1u1m.pdf; Height: 0.6mm; Device Class L2: TVS Diodes; Temperature: -55°C to +150°C; Category: Diode; Temperature Range Low: -55°C; Digikey Description: TVS DIODE 22V 41V 1610; Reverse Standoff Voltage: 22V; Lead Free: Yes; Automotive: No; RoHS: TRUE; Manufacturer Part Number: ESDA25P35-1U1M; Temperature Range High: +150°C; Package: QFN_1610; Device Class L1: Circuit Protection; Device Class L3: unset; ComponentLink2Description: Datasheet; Octopart: https://octopart.com/esda25p35-1u1m-stmicroelectronics-75302699; Mouser Description: ESDA Series 1400 W 25 V Uni-Directional Surface Mount TVS Diode - QFN-1610
D402 = CMP-08607-000108-1: TVS DIODE 24V 38.9V SOD123F; Breakdown Voltage: 29.5V; Number of Unidirectional Channels: 1; Power Line Protection: No; Peak Pulse Power: 200W; Polarity: Unidirectional; Reverse Breakdown Voltage: 26.7V; Test Current: 1mA; Leakage Current: 1uA; Max Surge Current: 5.1A; Packaging: Tape and Reel; Min Operating Temperature: -55°C; Number of Channels: 1; Composition: Zener; Clamping Voltage: 38.9V; Termination: SMD/SMT; Max Breakdown Voltage: 29.5V; Reverse Standoff Voltage: 24V; Mount: Surface Mount; Number of Pins: 2; Min Breakdown Voltage: 26.7V; Peak Pulse Current: 5.1A; Max Operating Temperature: 150°C; Number of Elements: 1; Lead Free: Lead Free
D403 = CMP-22017-000005-2: LED GREEN CLEAR CHIP SMD; Dominant Wavelength: 569nm; Reverse Voltage: 5V; Lens Color: Colorless; Viewing Angle: 130°; Voltage: 2V; Forward Current: 30mA; Power Dissipation: 100mW; Luminous Intensity: 6mcd; Number of LEDs: 1; Forward Voltage: 2.1V; Wavelength: 565nm; Test Current: 10mA; Min Operating Temperature: -55°C; Lens Style: Clear; Mount: Surface Mount; Width: 0.8mm; Packaging: Tape and Reel; Lens Transparency: Clear; Case Code (Metric): 1608; Depth: 0.8mm; Case Code (Imperial): 0603; Case/Package: 0603; Number of Pins: 2; Max Operating Temperature: 85°C; Lead Free: Lead Free; Number of Elements: 1; Length: 1.6mm; Height: 0.8mm; Package Quantity: 1; Power Rating: 100mW; Radiation Hardening: No; Illumination Color: Green; Color: Green
J401 = CMP-002-00072-1: Conn USB 3.1 Type C RCP 24 POS 0.5mm/0.4mm Solder RA SMD/Thru-Hole 24 Terminal 1 Port T/R; Gender: Receptacle; Voltage Rating: 20V; Pins: 24; Min Operating Temperature: -40°C; Max Operating Temperature: 105°C; Mounting Technology: Surface Mount, Through Hole; Connector Type: USB
Q401 = CMP-013-00034-1: P-channel 30 V, 0.024 Ohm typ., 6 A STripFET H6 Power MOSFET in a PowerFLAT 3.3 x 3.3 package; Pins: 8; Max Operating Temperature: 150°C; Mounting Technology: Surface Mount
R401 = CMP-2002-07353-1: Part Number: RC0402FR-0710KL; Manufacturer: Yageo / Phycomp
R402 = CMP-2002-07344-1: as R203 on sheet SoM
R403 R408 = CMP-2100-03616-1: as R208 on sheet SoM; Case Code (Imperial): 1206; Length: 3.2mm; Case/Package: 1206; Contact Plating: Tin; Package Quantity: 10; Datasheet URL: http://www.farnell.com/datasheets/1720486.pdf; Mount: SurfaceMount; Package Description: 2-Pin Surface Mount Device, Body 3.15 x 1.6 mm; Package Reference: 1206.0; Max Operating Temperature: 155degC; Lead Free: LeadFree; Weight: 0.000353oz; Military Standard: Not; Max Power Dissipation: 250mW; Case Code (Metric): 3216; Number of Terminations: 2; Tolerance: 1%; Width: 0.063inch; Termination: SMD/SMT; Number of Pins: 2; Min Operating Temperature: -55degC; Height: 0.55mm; Depth: 1.6mm; RoHSCompliant: true; Composition: ThickFilm; Packaging: TapeandReel; Manufacturer URL: http://www.vishay.com/; Voltage Rating: 200V; Radiation Hardening: No; REACH SVHC: Unknown; Datasheet Version: 41061.0
R404 R407 = CMP-2002-07913-2: as R202 on sheet SoM; Tolerance: 5%; Packaging: Tape and Reel; Termination: SMD/SMT; Case Code (Metric): 1005; Length: 1mm; Power Rating: 63mW; Min Operating Temperature: -55°C; Case/Package: 0402; Construction: Rectangular; Series: RC; Resistance Tolerance: 5%; Height: 0.016inch; Case Code (Imperial): 0402; RoHS Compliant: Yes; Size Code: 0402; Number of Terminations: 2; Features: Moisture Resistant; Width: 0.02inch; Max Operating Temperature: 155°C; Military Standard: Not; Lead Free: Lead Free; Depth: 0.5mm; Package Quantity: 1; Resistor Type: Thick Film
R405 = CMP-2002-07343-1: Part Number: RC0402FR-07100KL; Manufacturer: Yageo / Phycomp
R406 = CMP-1011-00659-2: Part Number: CRCW040222K0FKED; Manufacturer: Vishay Dale
R409 = CMP-2002-05217-1: Manufacturer: Bourns; Part Number: CR0402-FX-4701GLF
R410 R411 = CMP-2002-07517-1: Manufacturer: Yageo / Phycomp; Part Number: RC0402FR-0722KL
U401 = CMP-12113-000003-3: 4.1V~22V USB 2.0 I2C Controllers Interface ICs STUSB45 Controller 24-VFQFN Exposed Pad; Number of Ports: 1; Min Supply Voltage: 3V; Max Junction Temperature (Tj): 145°C; Max Supply Voltage: 22V; Interface: I2C, USB; USB Standard: USB 2.0; Lifecycle Status: Production; Schedule B: 8542390000, 8542390000; Min Operating Temperature: -40°C; Ambient Temperature Range High: 105°C; Max Operating Temperature: 105°C; Height: 1mm
U402-U404 = CMP-04985-000004-1: TVS DIODE 5.5V 14V 10USON; Manufacturer: Texas Instruments; Direction: Unidirectional; Standoff Height: 0mm; Capacitance: 0.5pF; Number Of Channels: 4; Breakdown Voltage: 6.4V; Peak Pulse Power: 2.5W; Automotive Grade: Grade 1; Value: 0.5pF; Interface: USB,Ethernet,LVDS,Other; Peak Pulse Current: 2.5A; Operating Supply Voltage: 5.5V; Reverse Standoff Voltage: 5.5V; Package: DQA0010A; Temperature Range Low: -40°C; Temperature Range High: +125°C; Ambient Temperature Range Low: -40°C; Device Class L1: Circuit Protection; Clamping Voltage: 14V; Manufacturer Part Number: TPD4E05U06QDQARQ1; Device Class L2: ESD and Circuit Protection ICs; Octopart: https://octopart.com/tpd4e05u06qdqarq1-texas+instruments-48523459; Device Class L3: unset; Height: 0.55mm; Automotive: Yes; ComponentLink2Description: Datasheet; RoHS: TRUE; Ambient Temperature Range High: +125°C; Category: IC; Mouser Description: Automotive 4-Channel ESD Protection Solution for SuperSpeed (up to 5 Gbps) Interface 10-USON -40 to 125; Temperature: -40°C to +125°C; ComponentLink2URL: http://www.ti.com/lit/ds/symlink/tpd4e05u06-q1.pdf; Digikey Description: TVS DIODE 5.5V 14V 10USON; Lead Free: Yes